# EAGLE design ArduinoHub08Shield (EAGLE 7.2.0)
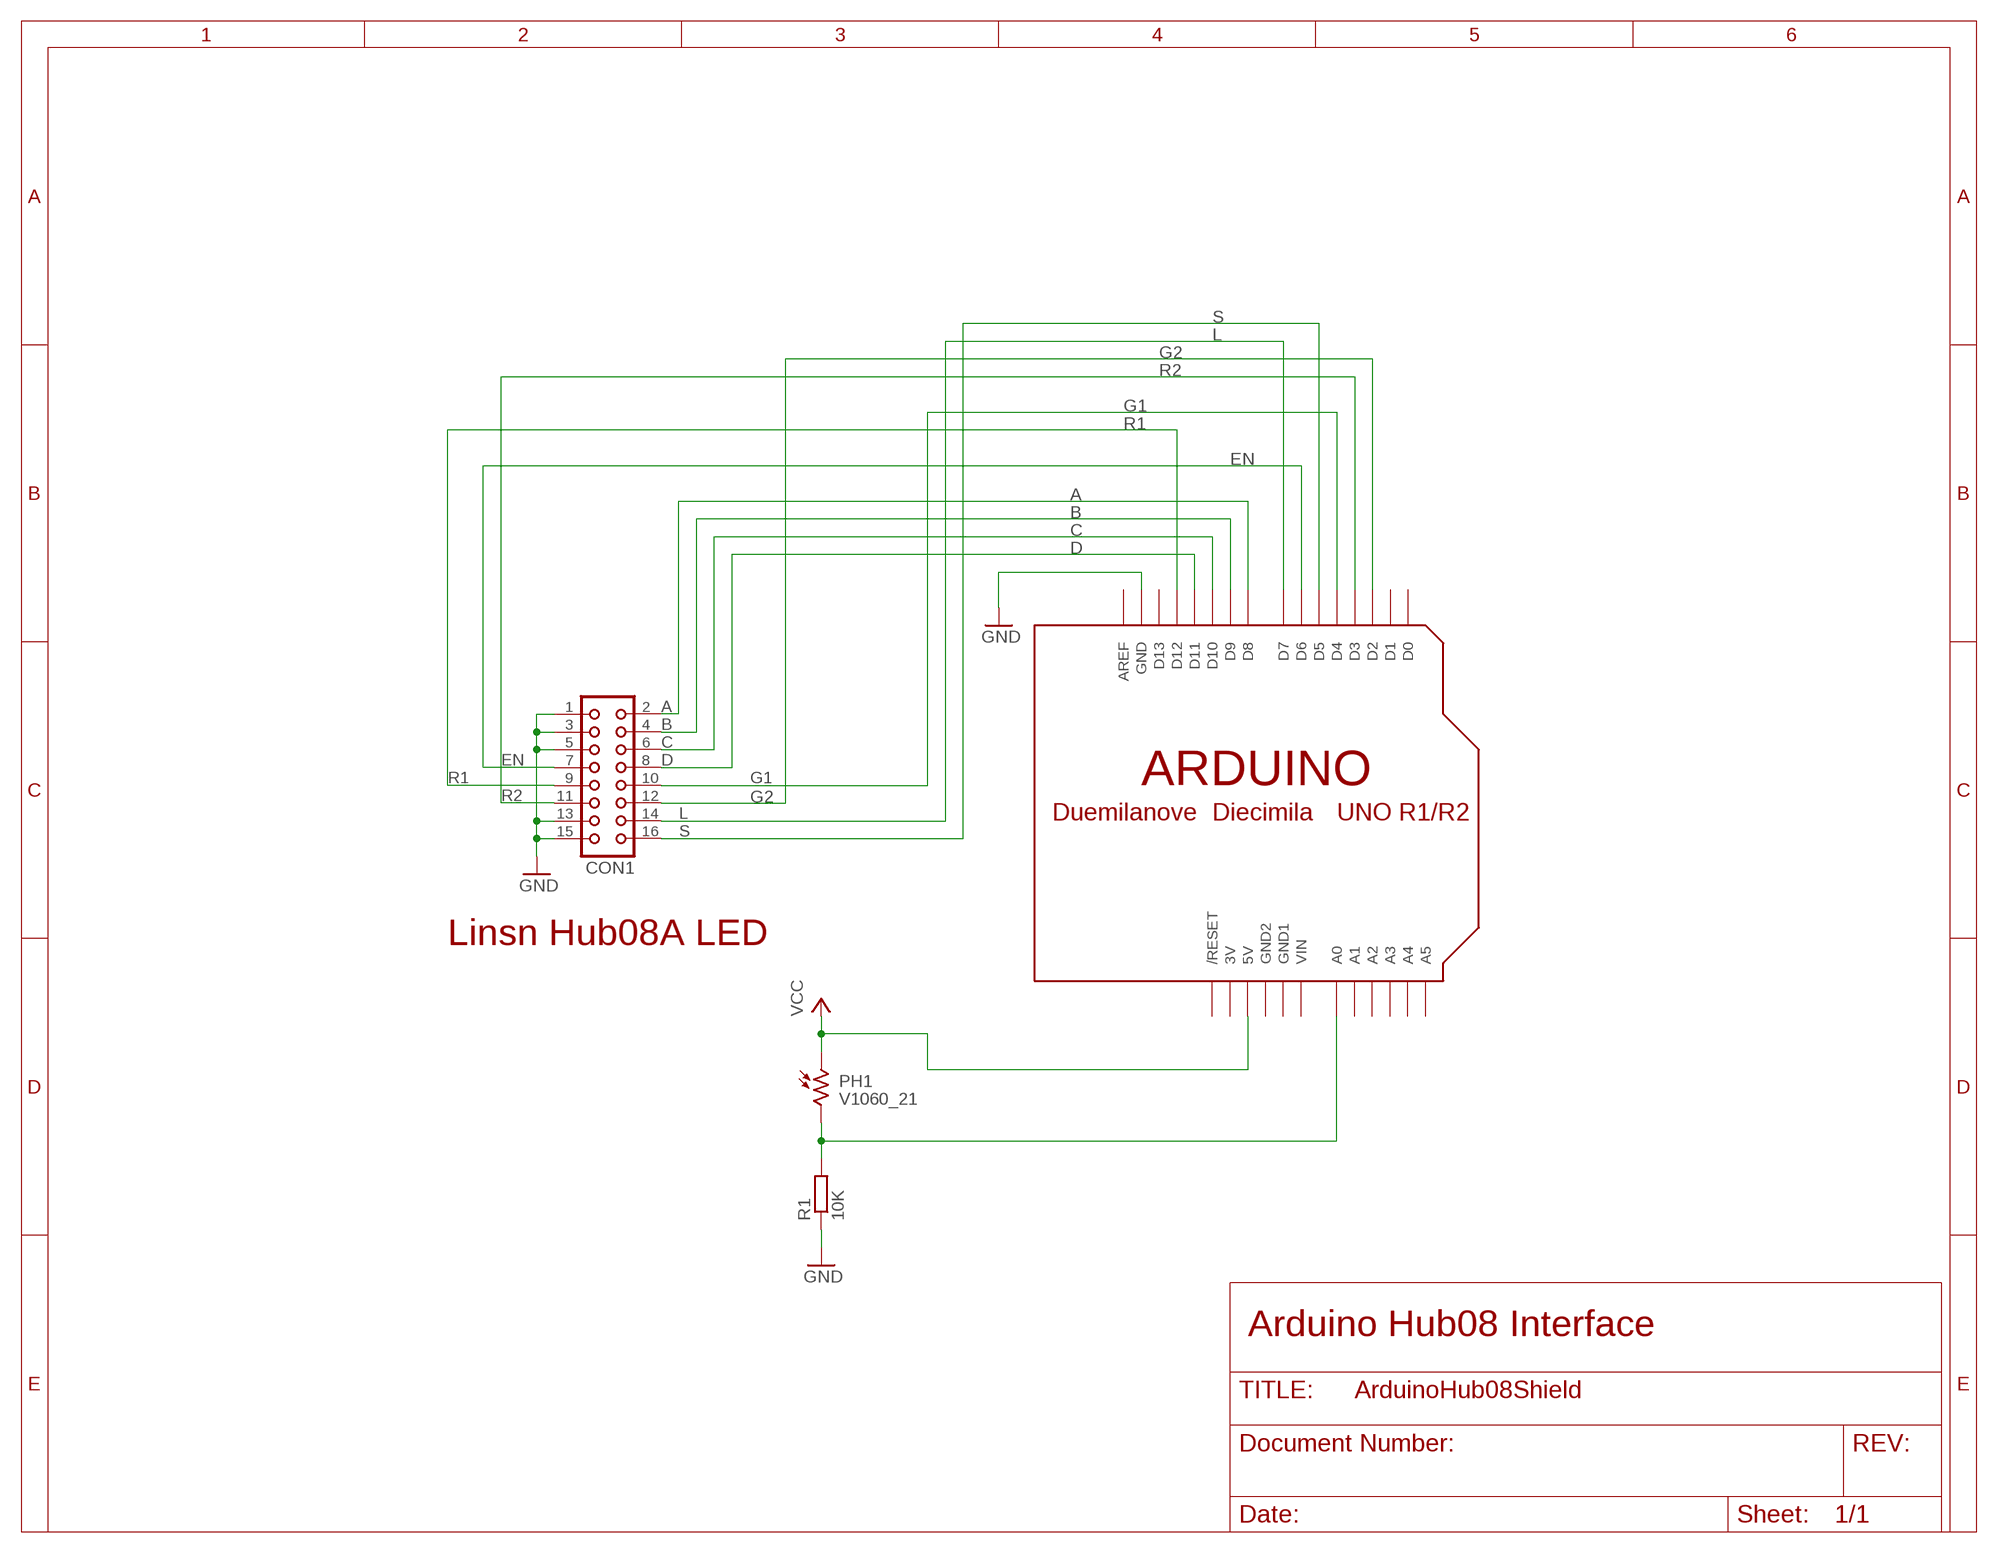
[diagram p0: schematic, sheet 1]

## Parts
CON1  CON16  [CON16]
PH1  V1060_21  [TO-5_V10]
R1  10K  R-EU_0204/7  [0204/7]
U$1  ARDUINO-NOHOLE  [ARDUINO-NOHOLE]

## Nets
A: CON1.2 U$1.D8
B: CON1.4 U$1.D9
C: CON1.6 U$1.D10
D: CON1.8 U$1.D11
EN: CON1.7 U$1.D6
G1: CON1.10 U$1.D4
G2: CON1.12 U$1.D2
GND: CON1.1 CON1.3 CON1.5 CON1.13 CON1.15 R1.1 U$1.GND
L: CON1.14 U$1.D7
N$1: PH1.2 R1.2 U$1.A0
R1: CON1.9 U$1.D12
R2: CON1.11 U$1.D3
S: CON1.16 U$1.D5
VCC: PH1.1 U$1.5V
Unconnected: U$1.A1 U$1.A2 U$1.A3 U$1.A4 U$1.A5 U$1.AREF U$1.D0 U$1.D1 U$1.D13 U$1.RESET(/RESET)

## Notes on the sheet
- Linsn Hub08A LED
- Arduino Hub08 Interface

## Power pins joined to a net without a drawn wire
3V: U$1.3V
GND1: U$1.GND1
GND2: U$1.GND2
VIN: U$1.VIN

## Library data of the parts
CON1 = con-harting:CON16: CONNECTOR; OC_FARNELL: unknown; OC_NEWARK: unknown
PH1 = photo-elements:?1060*: Sensor Street Light control Source: http://optoelectronics.perkinelmer.com/content/Datasheets/DTS_PhotocellsB1060.pdf
R1 = rcl:R-EU_: RESISTOR, European symbol
U$1 = adafruit:ARDUINO: Arduino Diecimila/Duemilanove Make a shield with ease, this package has all the named pins as well as the two mounting drill holes and an outline of the USB and DC power connector. The outline is on the DIMENSION layer, so if your board house uses it they will cut the outline to match. http://www.ladyada.net/library/pcb/eaglelibrary.html

## Board
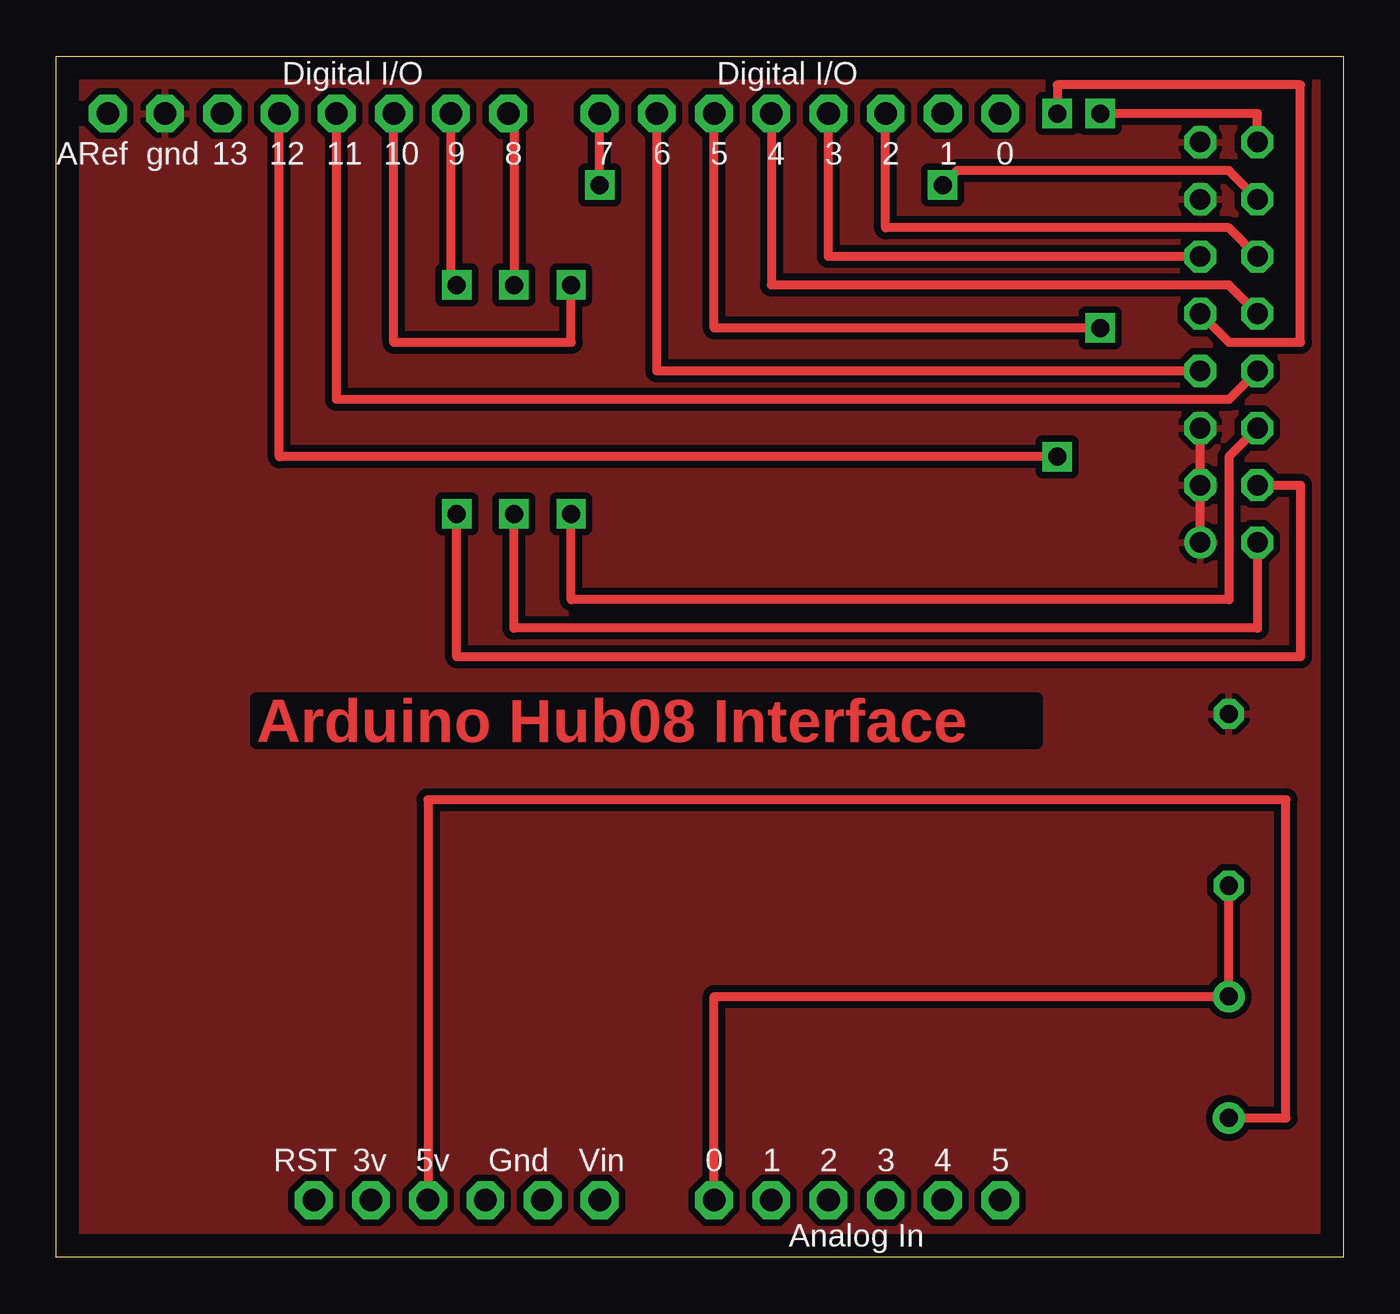
[diagram p1: board, top side]
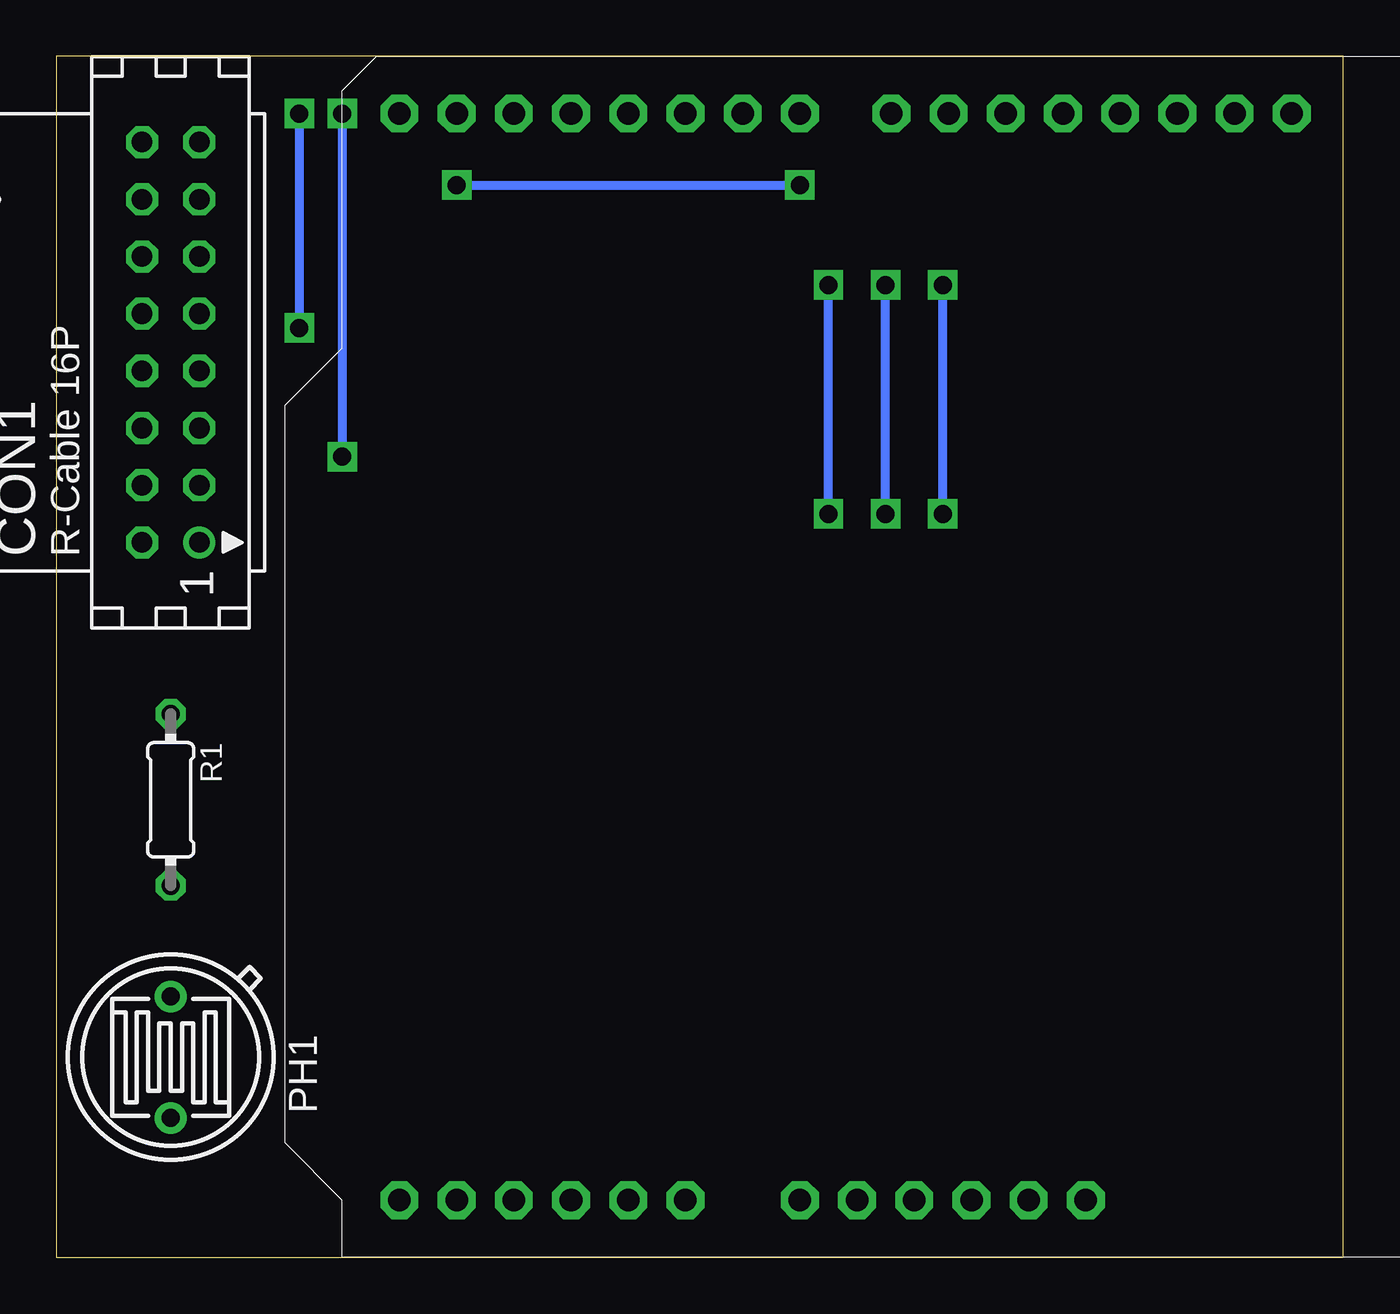
[diagram p2: board, bottom side, seen from below]

Size 57.15 x 53.34 mm. Coordinates in mm from the lower left corner, seen from the top.
Outline: 0,0 0,53.34 57.15,53.34 57.15,0 0,0
Copper layers (1*16): Top 0.035mm / dielectric 1.5mm / Bottom 0.035mm
Design rules "default *": minimum track width 10mil, minimum drill 24mil, track to track 12mil, track to pad 12mil, pad to pad 8mil, via to via 8mil, smd to smd 8mil, copper to edge 40mil, drill to drill 8mil, minimum pad ring 10mil, minimum via ring 10mil, stop-mask expansion 4mil, vias tented up to drill 0mil, thermal gap 10mil

### Footprints (pad centres in the part's own frame; a part is rotated, then mirrored left to right if it is on the bottom)
CON16 = drill 0.914: 1 -8.89,-1.27 | drill 0.914 octagon: 2 -8.89,1.27; 3 -6.35,-1.27; 4 -6.35,1.27; 5 -3.81,-1.27; 6 -3.81,1.27; 7 -1.27,-1.27; 8 -1.27,1.27; 9 1.27,-1.27; 10 1.27,1.27; 11 3.81,-1.27; 12 3.81,1.27; 13 6.35,-1.27; 14 6.35,1.27; 15 8.89,-1.27; 16 8.89,1.27
TO-5_V10 = drill 0.8 pad 1.4: 1 -2.7,0; 2 2.7,0
0204/7 = drill 0.813 octagon: 1 -3.81,0; 2 3.81,0
ARDUINO-NOHOLE = drill 1 pad 1.676 octagon: 3V 35.56,2.54; 5V 38.1,2.54; A0 50.8,2.54; A1 53.34,2.54; A2 55.88,2.54; A3 58.42,2.54; A4 60.96,2.54; A5 63.5,2.54; AREF 23.876,50.8; D0 63.5,50.8; D1 60.96,50.8; D2 58.42,50.8; D3 55.88,50.8; D4 53.34,50.8; D5 50.8,50.8; D6 48.26,50.8; D7 45.72,50.8; D8 41.656,50.8; D9 39.116,50.8; D10 36.576,50.8; D11 34.036,50.8; D12 31.496,50.8; D13 28.956,50.8; GND 26.416,50.8; GND1 43.18,2.54; GND2 40.64,2.54; RESET 33.02,2.54; VIN 45.72,2.54

### Placement (x,y rotation side)
CON1  52.07,40.64 90 bottom
PH1  52.07,8.89 90 bottom
R1  52.07,20.32 270 bottom
U$1  -21.59,0 0 top

### Tracks (layer width: path | path; a pad name or v marks a point on that pad's centre or on a via)
A  (via drill 0.8)
  Top 0.406: CON1.2 53.34,27.94 20.32,27.94 v20.32,33.02 | U$1.D8 20.32,50.8 v20.32,43.18
  Bottom 0.406: v20.32,33.02 v20.32,43.18
B  (via drill 0.8)
  Top 0.406: CON1.4 55.24,34.29 55.24,26.67 17.78,26.67 v17.78,33.02 | v17.78,43.18 17.53,43.18 U$1.D9
  Bottom 0.406: v17.78,33.02 v17.78,43.18
C  (via drill 0.8)
  Top 0.406: CON1.6 52.07,35.56 52.07,29.21 22.86,29.21 v22.86,33.02 | U$1.D10 14.99,40.64 22.86,40.64 v22.86,43.18
  Bottom 0.406: v22.86,33.02 v22.86,43.18
D
  Top 0.406: CON1.8 52.07,38.1 12.45,38.1 U$1.D11
EN
  Top 0.406: CON1.7 26.67,39.37 U$1.D6
G1
  Top 0.406: CON1.10 52.07,43.18 31.75,43.18 U$1.D4
G2
  Top 0.406: CON1.12 52.07,45.72 36.83,45.72 U$1.D2
GND
  Top 0.406: CON1.1 CON1.3 CON1.5
  pour Top: 0,53.34 0,0 57.15,0 57.15,53.34
L  (via drill 0.8)
  Top 0.406: CON1.14 52.07,48.26 40,48.26 v39.37,47.62 | v24.13,47.62 U$1.D7
  Bottom 0.406: v39.37,47.62 v24.13,47.62
N$1
  Top 0.406: U$1.A0 29.21,11.59 PH1.2 R1.2
R1  (via drill 0.8)
  Top 0.406: CON1.9 52.07,40.64 55.24,40.64 55.24,52.07 44.45,52.07 v44.45,50.8 | v44.45,35.56 9.91,35.56 U$1.D12
  Bottom 0.406: v44.45,50.8 v44.45,35.56
R2
  Top 0.406: CON1.11 34.29,44.45 U$1.D3
S  (via drill 0.8)
  Top 0.406: CON1.16 53.34,50.8 v46.35,50.8 | v46.35,41.27 29.21,41.27 U$1.D5
  Bottom 0.406: v46.35,50.8 v46.35,41.27
VCC
  Top 0.406: PH1.1 54.61,6.19 54.61,20.32 16.51,20.32 U$1.5V

### Text on the board
Top: Arduino Hub08 Interface